# EAGLE schematic melody (EAGLE 7.7.0)
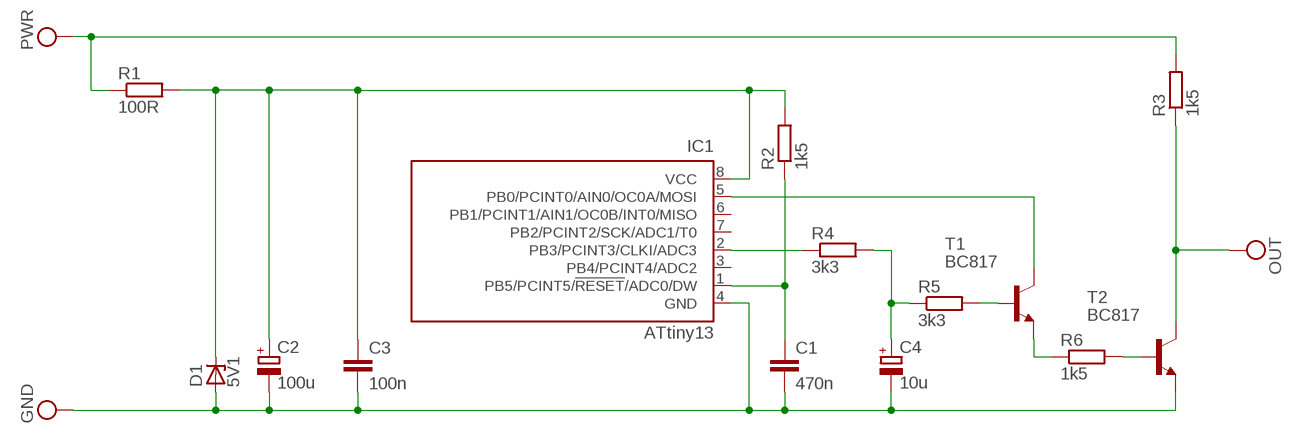
[diagram p0: schematic, sheet 1]

## Parts
C1  470n  C2,5-3  [C2.5-3]
C2  100u  CPOL-EU085CS-1AR  [085CS_1AR]
C3  100n  C2,5-3  [C2.5-3]
C4  10u  CPOL-EU085CS-1AR  [085CS_1AR]
D1  5V1  BZX85  [DO41Z10]
IC1  ATtiny13  TINY13-20PU  [DIL08]
R1  100R  R-EU_0204/2V  [0204V]
R2  1k5  R-EU_0204/2V  [0204V]
R3  1k5  R-EU_0204/2V  [0204V]
R4  3k3  R-EU_0204/2V  [0204V]
R5  3k3  R-EU_0204/2V  [0204V]
R6  1k5  R-EU_0204/2V  [0204V]
T1  BC817  -NPN-SOT23-EBC  [SOT23-EBC]
T2  BC817  -NPN-SOT23-EBC  [SOT23-EBC]

## Nets
N$1: C1.1 IC1.1(PB5/PCINT5/!RESET!/ADC0/DW) R2.1
N$2: IC1.2(PB3/PCINT3/CLKI/ADC3) R4.1
N$3: C2.+ C3.1 D1.C IC1.8(VCC) R1.2 R2.2
N$5: C4.+ R4.2 R5.1
N$7: R5.2 T1.B
N$8: IC1.5(PB0/PCINT0/AIN0/OC0A/MOSI) T1.C
N$9: R6.1 T1.E
N$10: R6.2 T2.B
VCC: C1.2 C2.- C3.2 C4.- D1.A IC1.4(GND) R1.1 R3.1 R3.2 T2.C T2.E ; supply symbol labelled GND, OUT, PWR
Unconnected: IC1.3(PB4/PCINT4/ADC2) IC1.6(PB1/PCINT1/AIN1/OC0B/INT0/MISO) IC1.7(PB2/PCINT2/SCK/ADC1/T0)

## Library data of the parts
C1 C3 = capacitor-wima:C: CAPACITOR naming: grid - package width
C2 C4 = rcl:CPOL-EU: POLARIZED CAPACITOR, European symbol
D1 = diode:BZX85: Z DIODE
IC1 = atmel:TINY13: 8-bit AVR Microcontroller with 1K Bytes In-System Programmable Flash Source: http://www.atmel.com/dyn/resources/prod_documents/2535S.pdf; MPN: ATTINY13-20PU; OC_FARNELL: 9171550; OC_NEWARK: 96K6521
R1-R6 = rcl:R-EU_: RESISTOR, European symbol
T1 T2 = transistor:*-NPN-: NPN Transistror BF959 corrected 2008.03.06